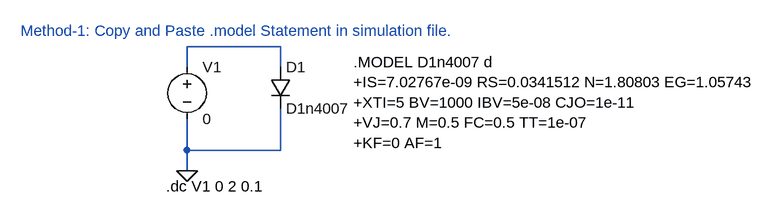
[diagram p0: schematic Method-1 Copy and Paste Model.asc]
Method-1 Copy and Paste Model.asc, the LTspice schematic file:
Version 4
SHEET 1 924 680
WIRE 128 96 -16 96
WIRE -16 128 -16 96
WIRE 128 128 128 96
WIRE -16 256 -16 208
WIRE 128 256 128 192
WIRE 128 256 -16 256
WIRE -16 288 -16 256
FLAG -16 288 0
SYMBOL diode 112 128 R0
SYMATTR InstName D1
SYMATTR Value D1n4007
SYMBOL voltage -16 112 R0
WINDOW 123 0 0 Left 0
WINDOW 39 0 0 Left 0
SYMATTR InstName V1
SYMATTR Value 0
TEXT -48 312 Left 2 !.dc V1 0 2 0.1
TEXT -272 72 Left 2 ;Method-1: Copy and Paste .model Statement in simulation file.
TEXT 240 120 Left 2 !.MODEL D1n4007 d\n+IS=7.02767e-09 RS=0.0341512 N=1.80803 EG=1.05743\n+XTI=5 BV=1000 IBV=5e-08 CJO=1e-11\n+VJ=0.7 M=0.5 FC=0.5 TT=1e-07\n+KF=0 AF=1

The netlist it stands for:
* Method-1 Copy and Paste Model.asc
D1 N001 0 D1n4007
V1 N001 0 0
.model D D
.lib standard.dio
.dc V1 0 2 0.1
* Method-1: Copy and Paste .model Statement in simulation file.
.MODEL D1n4007 d
+IS=7.02767e-09 RS=0.0341512 N=1.80803 EG=1.05743
+XTI=5 BV=1000 IBV=5e-08 CJO=1e-11
+VJ=0.7 M=0.5 FC=0.5 TT=1e-07
+KF=0 AF=1
.backanno
.end